# EAGLE design GardenJarLight_V1 (EAGLE 7.5.0)
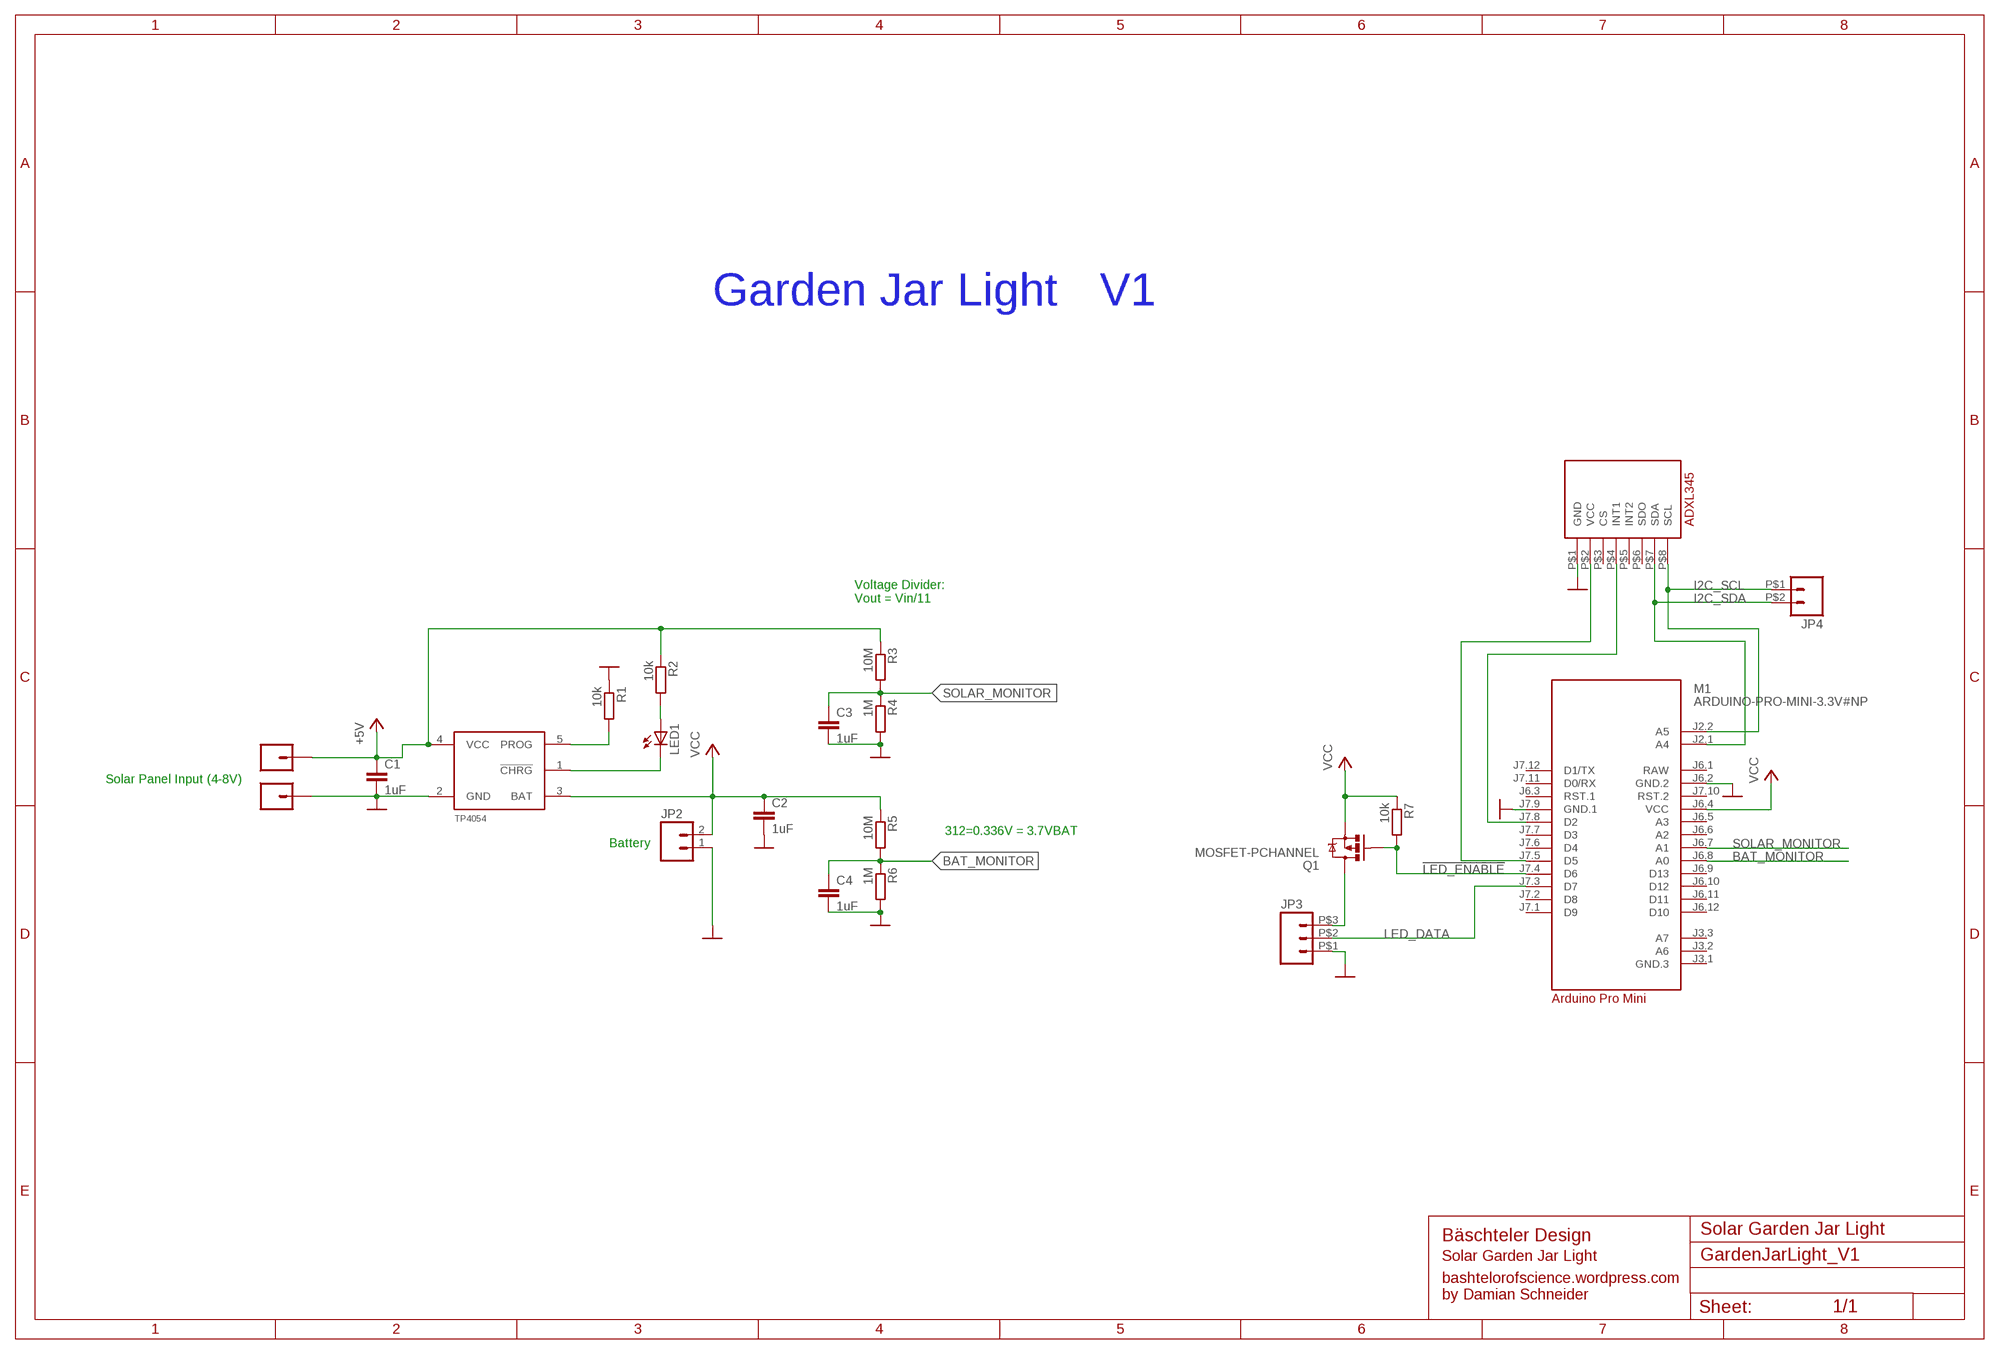
[diagram p0: schematic, sheet 1]

## Parts
C1  1uF  C-EUC0805  [C0805]
C2  1uF  C-EUC0805  [C0805]
C3  1uF  C-EUC0805  [C0805]
C4  1uF  C-EUC0805  [C0805]
IC1  TP4054_LIPO_CHARGER  [SOT23-5]
JP1  M01PTH  [1X01]
JP2  M021X02_NO_SILK  [1X02_NO_SILK]
JP3  M03SMD_LONG  [SMD_HEADER_3P_LONG]
JP4  M02  [SMD_HEADER_2P]
JP5  M01PTH  [1X01]
LED1  LEDCHIPLED_0805  [CHIPLED_0805]
M1  ARDUINO-PRO-MINI-3.3V#NP  [ARDUINO-PRO-MINI#NP]
Q1  MOSFET-PCHANNEL  [SOT23-3]
R1  10k  R-EU_R0805  [R0805]
R2  10k  R-EU_R0805  [R0805]
R3  10M  R-EU_R0805  [R0805]
R4  1M  R-EU_R0805  [R0805]
R5  10M  R-EU_R0805  [R0805]
R6  1M  R-EU_R0805  [R0805]
R7  10k  R-EU_R0805  [R0805]
U$1  ADXL345  [ADXL345]

## Nets
!LED_ENABLE: M1.J7.4(D6) Q1.1(G) R7.2
+5V: C1.1 IC1.4(VCC) JP1.1 R2.1 R3.1
BAT_MONITOR: C4.1 M1.J6.8(A0) R5.2 R6.1
GND: C1.2 C2.2 C3.2 C4.2 IC1.2(GND) JP2.1 JP3.P$1 JP5.1 M1.J6.2(GND.2) M1.J7.9(GND.1) R1.1 R4.2 R6.2 U$1.P$1(GND)
I2C_SCL: JP4.P$1 M1.J2.2(A5) U$1.P$8(SCL)
I2C_SDA: JP4.P$2 M1.J2.1(A4) U$1.P$7(SDA)
LED_DATA: JP3.P$2 M1.J7.3(D7)
N$1: JP3.P$3 Q1.3(D)
N$3: IC1.1(!CHRG) LED1.C
N$4: IC1.5(PROG) R1.2
N$7: M1.J7.8(D2) U$1.P$4(INT1)
N$9: M1.J7.5(D5) U$1.P$2(VCC)
N$37: LED1.A R2.2
SOLAR_MONITOR: C3.1 M1.J6.7(A1) R3.2 R4.1
VCC: C2.1 IC1.3(BAT) JP2.2 M1.J6.4(VCC) Q1.2(S) R5.1 R7.1
Unconnected: M1.J3.1(GND.3) M1.J3.2(A6) M1.J3.3(A7) M1.J6.3(RST.1) M1.J6.5(A3) M1.J6.6(A2) M1.J6.9(D13) M1.J6.10(D12) M1.J6.11(D11) M1.J6.12(D10) M1.J7.1(D9) M1.J7.2(D8) M1.J7.6(D4) M1.J7.7(D3) M1.J7.10(RST.2) M1.J7.11(D0/RX) M1.J7.12(D1/TX) U$1.P$3(CS) U$1.P$5(INT2) U$1.P$6(SDO)

## Notes on the sheet
- Garden Jar Light | V1
- Voltage Divider:
  Vout = Vin/11
- Solar Panel Input (4-8V)
- 312=0.336V = 3.7VBAT
- Battery
- Arduino Pro Mini
- Solar Garden Jar Light
- Bäschteler Design
- Solar Garden Jar Light
- bashtelorofscience.wordpress.com
  by Damian Schneider

## Power pins joined to a net without a drawn wire
RAW: M1.J6.1(RAW)

## Library data of the parts
C1-C4 = resistor:C-EU: CAPACITOR, European symbol
IC1 = TP4054_lipocharger:TP4054_LIPO_CHARGER
JP1 JP5 = SparkFun-Connectors:M01: Header 1 Standard 1-pin 0.1" header. Use with straight break away headers (SKU : PRT-00116), right angle break away headers (PRT-00553), swiss pins (PRT-00743), machine pins (PRT-00117), and female headers (PRT-00115).
JP2 JP4 = smd_pinheader:M02: Standard 2-pin 0.1" header. Use with - straight break away headers ( PRT-00116) - right angle break away headers (PRT-00553) - swiss pins (PRT-00743) - machine pins (PRT-00117) - female headers (PRT-00115) Molex polarized connector foot print use with: PRT-08233 with associated crimp pins and housings. 2.54_SCREWTERM for use with PRT-10571. 3.5mm Screw Terminal footprints for PRT-08084 5mm Screw Terminal footprints for use with PRT-08432
JP3 = smd_pinheader:M03: Header 3 Standard 3-pin 0.1" header. Use with straight break away headers (SKU : PRT-00116), right angle break away headers (PRT-00553), swiss pins (PRT-00743), machine pins (PRT-00117), and female headers (PRT-00115). Molex polarized connector foot print use with SKU : PRT-08232 with associated crimp pins and housings.
LED1 = led:LED: LED OSRAM: - CHIPLED LG R971, LG N971, LY N971, LG Q971, LY Q971, LO R971, LY R971 LH N974, LH R974 LS Q976, LO Q976, LY Q976 LO Q996 - Hyper CHIPLED LW Q18S LB Q993, LB Q99A, LB R99A - SideLED LS A670, LO A670, LY A670, LG A670, LP A670 LB A673, LV A673, LT A673, LW A673 LH A674 LY A675 LS A676, LA A676, LO A676, LY A676, LW A676 LS A679, LY A679, LG A679 - Hyper Micro SIDELED® LS Y876, LA Y876, LO Y876, LY Y876 LT Y87S - SmartLED LW L88C, LW L88S LB L89C, LB L89S, LG L890 LS L89K, LO L89K, LY L89K LS L896, LA L896, LO L896, LY L896 - TOPLED LS T670, LO T670, LY T670, LG T670, LP T670 LSG T670, LSP T670, LSY T670, LOP T670, LYG T670 LG T671, LOG T671, LSG T671 LB T673, LV T673, LT T673, LW T673 LH T674 LS T676, LA T676, LO T676, LY T676, LB T676, LH T676, LSB T676, LW T676 LB T67C, LV T67C, LT T67C, LS T67K, LO T67K, LY T67K, LW E67C LS E67B, LA E67B, LO E67B, LY E67B, LB E67C, LV E67C, LT E67C LW T67C LS T679, LY T679, LG T679 LS T770, LO T770, LY T770, LG T770, LP T770 LB T773, LV T773, LT T773, LW T773 LH T774 LS E675, LA E675, LY E675, LS T675 LS T776, LA T776, LO T776, LY T776, LB T776 LHGB T686 LT T68C, LB T68C - Hyper Mini TOPLED® LB M676 - Mini TOPLED Santana® LG M470 LS M47K, LO M47K, LY M47K Source: http://www.osram.convergy.de LUXEON: - LUMILED® LXK2-PW12-R00, LXK2-PW12-S00, LXK2-PW14-U00, LXK2-PW14-V00 LXK2-PM12-R00, LXK2-PM12-S00, LXK2-PM14-U00 LXK2-PE12-Q00, LXK2-PE12-R00, LXK2-PE12-S00, LXK2-PE14-T00, LXK2-PE14-U00 LXK2-PB12-K00, LXK2-PB12-L00, LXK2-PB12-M00, LXK2-PB14-N00, LXK2-PB14-P00, LXK2-PB14-Q00 LXK2-PR12-L00, LXK2-PR12-M00, LXK2-PR14-Q00, LXK2-PR14-R00 LXK2-PD12-Q00, LXK2-PD12-R00, LXK2-PD12-S00 LXK2-PH12-R00, LXK2-PH12-S00 LXK2-PL12-P00, LXK2-PL12-Q00, LXK2-PL12-R00 Source: www.luxeon.com KINGBRIGHT: KA-3528ASYC Source: www.kingbright.com
M1 = diy-modules:ARDUINO-PRO-MINI-*#NP: Arduino Pro Mini (and compatible devices) without programming pads More details available here: https://www.arduino.cc/en/Main/ArduinoBoardProMini Click here to find device on ebay.com <http://www.ebay.com/sch/arduino+pro+mini>
Q1 = SparkFun-DiscreteSemi:MOSFET-PCHANNEL: Generic PMOSFET IRLML2244 - TRANS-11153 (SOT-23 -20V -4.3A) (1.Gate 2.Source 3.Drain) FQP27P06 - COM-10349 <http://www.sparkfun.com/products/10349> (TO-220 -60V -27A) (1.Gate 2.Source 3.Drain); PROD_ID: TRANS-08285
R1-R7 = resistor:R-EU_: RESISTOR, European symbol
U$1 = davidbeermann:ADXL345: ADXL345 Digital 3-Axis Accelerometer The sensor module ADXL345 is a 3-axis accelerometer with low power consumption. This module was purchased at Eckstein Komponente <http://eckstein-shop.de/GY-291-ADXL345-Digital-3-Axis-Gravity-Acceleration-Beschleunigung-Sensor_1>.

## Board
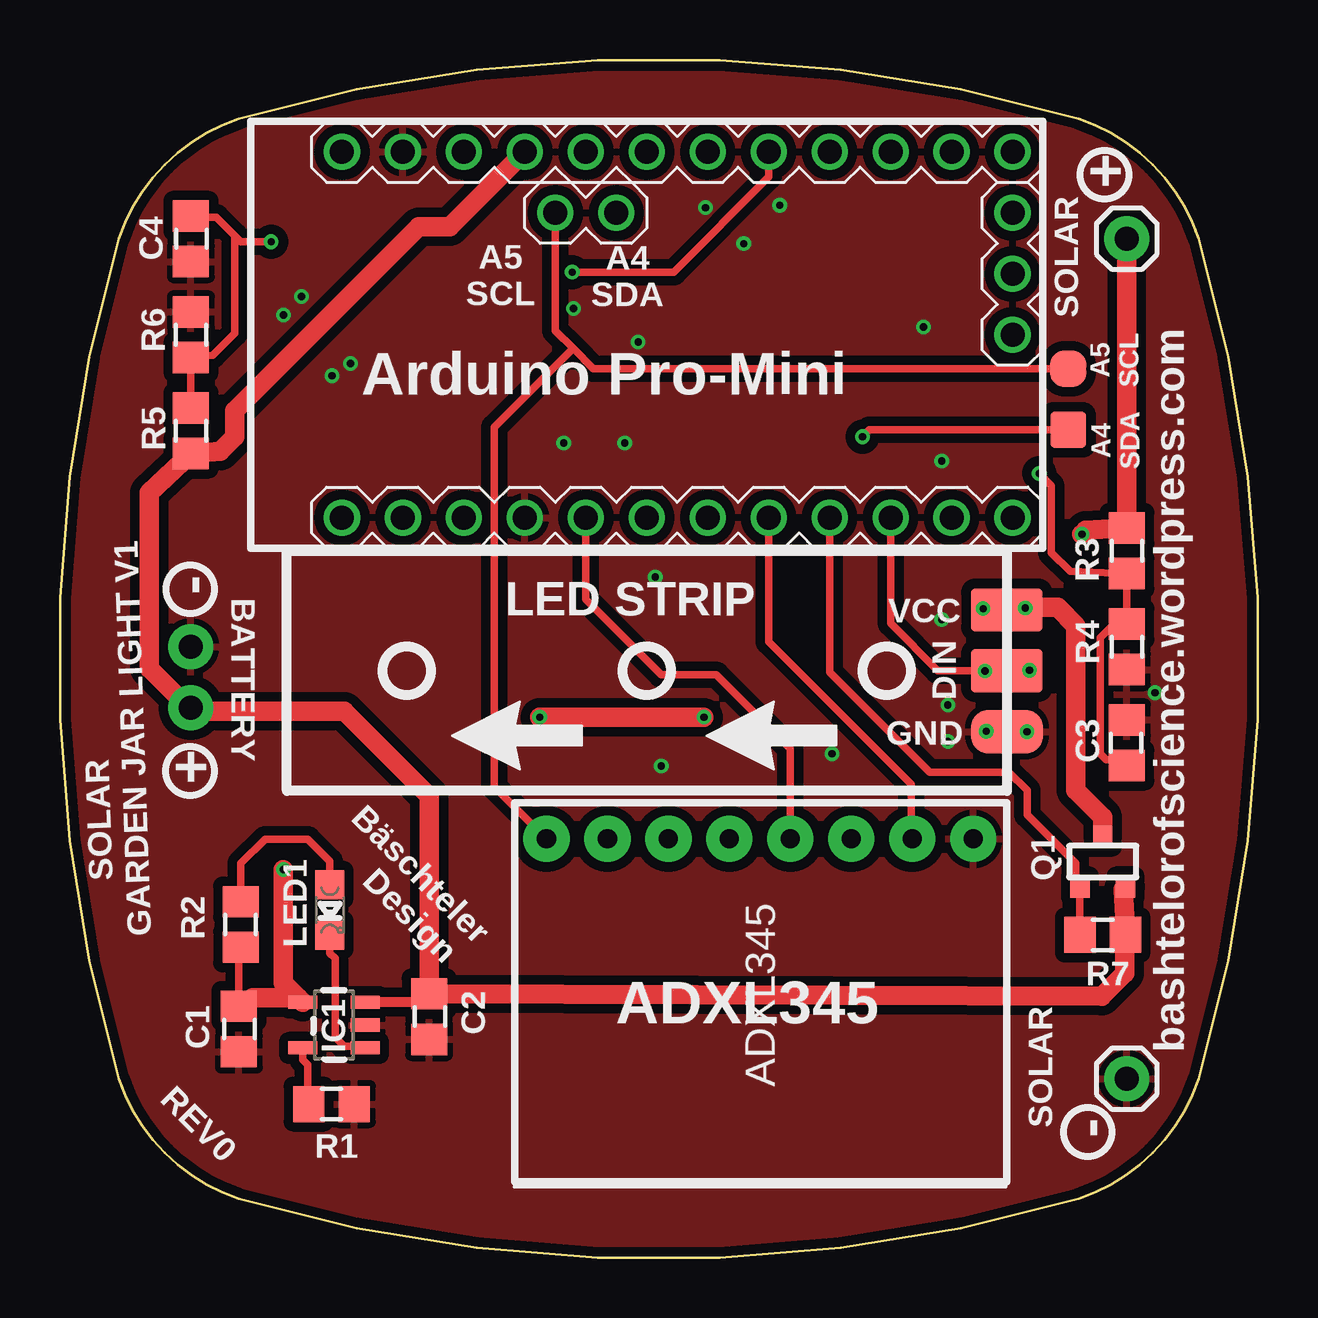
[diagram p1: board, top side]
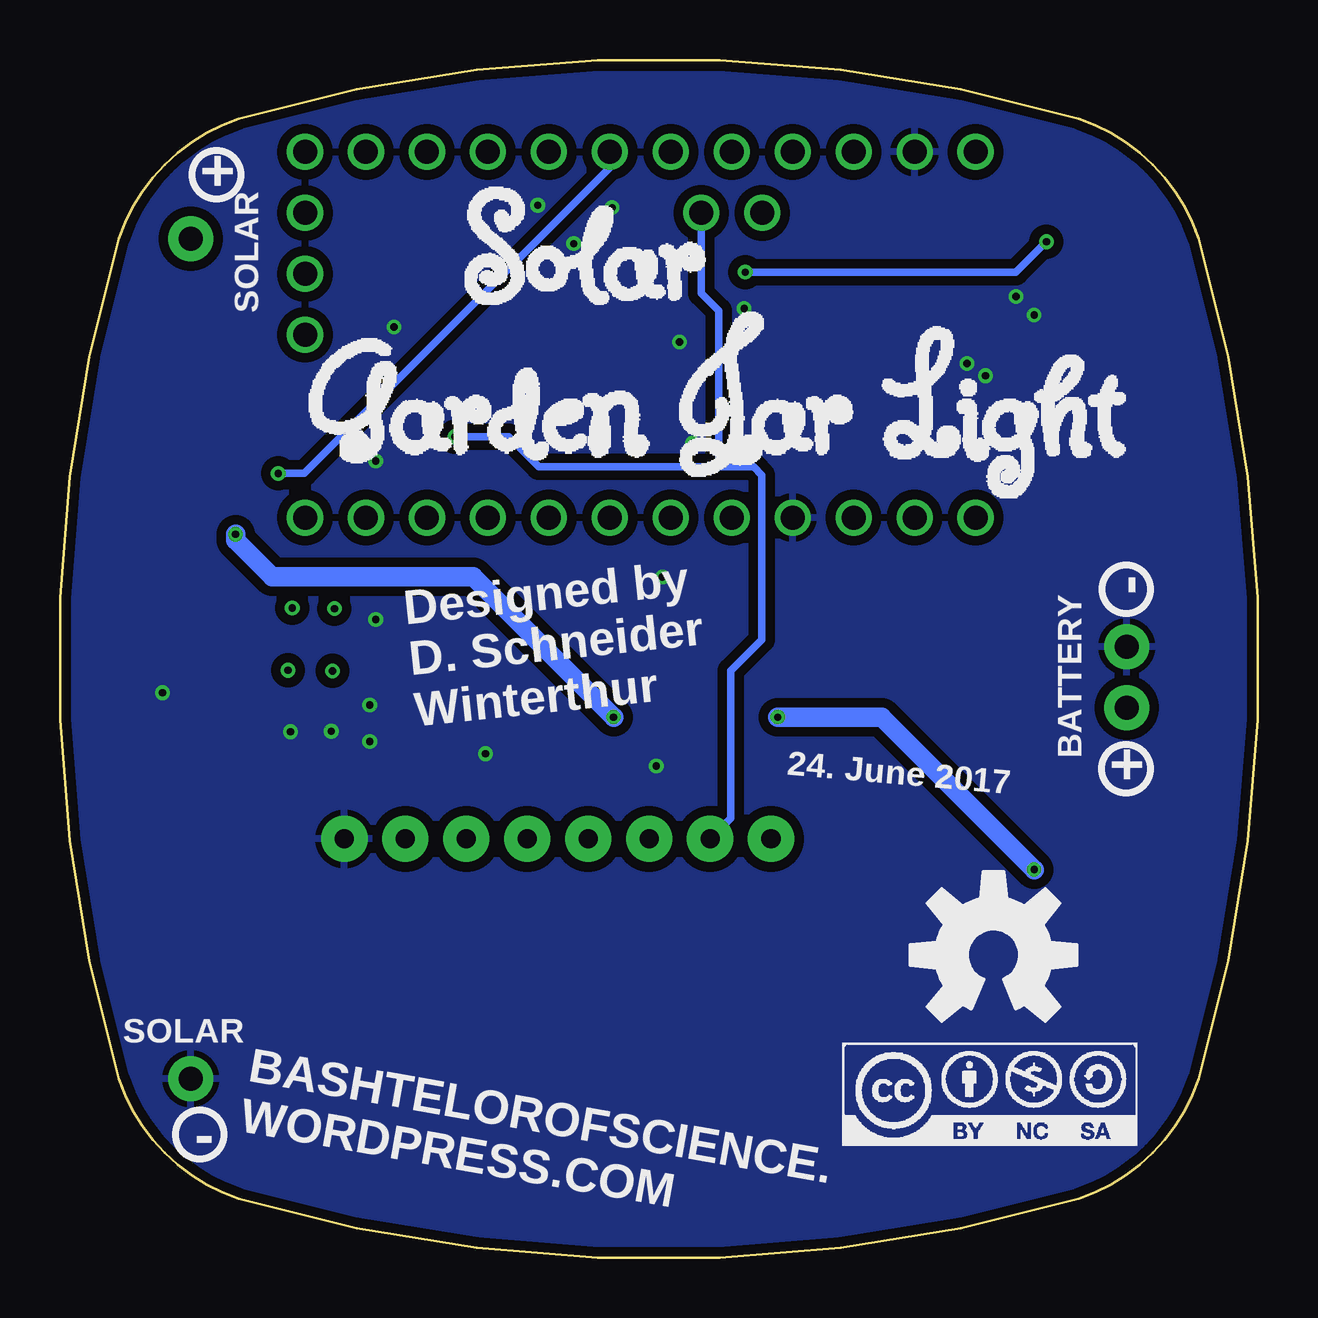
[diagram p2: board, bottom side, seen from below]

Size 49.9 x 49.9 mm. Coordinates in mm from the lower left corner, seen from the top.
Outline: 2.45,42.45 arc33 2.45,7.45 arc53 7.45,2.45 arc33 42.45,2.45 arc53 47.45,7.45 arc33 47.45,42.45 arc53 42.45,47.45 arc33 7.45,47.45 arc53 2.45,42.45
Copper layers (1*16): Top 0.035mm / dielectric 1.5mm / Bottom 0.035mm
Design rules "dirt_cheap_dirty_boards.v1 *": minimum track width 7mil, minimum drill 12mil, track to track 8mil, track to pad 8mil, pad to pad 8mil, via to via 8mil, smd to smd 0mil, copper to edge 10mil, drill to drill 10mil, minimum pad ring 10mil, minimum via ring 6mil, stop-mask expansion 2mil, vias tented up to drill 25mil, thermal gap 10mil

### Footprints (pad centres in the part's own frame; a part is rotated, then mirrored left to right if it is on the bottom)
C0805 = smd 1.3 x 1.5: 1 -0.95,0; 2 0.95,0
SOT23-5 = smd 0.55 x 1.2: 1 -0.95,-1.3; 2 0,-1.3; 3 0.95,-1.3; 4 0.95,1.3; 5 -0.95,1.3
1X01 = drill 1.016 pad 1.88: 1 0,0
1X02_NO_SILK = drill 1.016 pad 1.88: 1 0,0; 2 2.54,0
SMD_HEADER_3P_LONG = smd 1.8 x 3: P$1 -2.54,0; P$2 0,0; P$3 2.54,0
SMD_HEADER_2P = smd 1.5 x 1.5: P$1 0,0; P$2 2.54,0
CHIPLED_0805 = smd 1.2 x 1.2: A 0,-1.05; C 0,1.05
ARDUINO-PRO-MINI#NP = drill 1: J2.1 -1.27,5.08; J2.2 -3.81,5.08; J3.1 15.24,0; J3.2 15.24,2.54; J3.3 15.24,5.08; J6.1 -12.7,7.62; J6.2 -10.16,7.62; J6.3 -7.62,7.62; J6.4 -5.08,7.62; J6.5 -2.54,7.62; J6.6 0,7.62; J6.7 2.54,7.62; J6.8 5.08,7.62; J6.9 7.62,7.62; J6.10 10.16,7.62; J6.11 12.7,7.62; J6.12 15.24,7.62; J7.1 15.24,-7.62; J7.2 12.7,-7.62; J7.3 10.16,-7.62; J7.4 7.62,-7.62; J7.5 5.08,-7.62; J7.6 2.54,-7.62; J7.7 0,-7.62; J7.8 -2.54,-7.62; J7.9 -5.08,-7.62; J7.10 -7.62,-7.62; J7.11 -10.16,-7.62; J7.12 -12.7,-7.62
SOT23-3 = smd 0.8 x 0.9: 1 -0.95,-1; 2 0.95,-1; 3 0,1.1
R0805 = smd 1.3 x 1.5: 1 -0.95,0; 2 0.95,0
ADXL345 = drill 0.8 pad 1.93: P$1 0,0; P$2 0,-2.54; P$3 0,-5.08; P$4 0,-7.62; P$5 0,-10.16; P$6 0,-12.7; P$7 0,-15.24; P$8 0,-17.78

### Placement (x,y rotation side)
C1  7.45,9.52 270 top
C2  15.39,10.04 270 top
C3  44.45,21.45 90 top
C4  5.45,42.45 270 top
IC1  11.42,9.69 90 top
JP1  44.45,42.45 0 top
JP2  5.45,25.45 270 top
JP3  39.45,24.45 90 top
JP4  42.01,37.03 270 top
JP5  44.45,7.45 0 top
LED1  11.24,14.48 180 top
M1  24.45,38.45 0 top
Q1  43.45,16.45 0 top
R1  11.31,6.39 180 top
R2  7.53,13.88 90 top
R3  44.45,29.45 270 top
R4  44.45,25.45 270 top
R5  5.45,34.45 90 top
R6  5.45,38.45 90 top
R7  43.45,13.45 180 top
U$1  38.05,17.45 270 top
U$4  [CC-BY-NC-SA]  17.29,4.68 0 bottom
U$33  [OSHW-LOGO-L]  11,12.6 0 bottom

### Tracks (layer width: path | path; a pad name or v marks a point on that pad's centre or on a via)
!LED_ENABLE
  Top 0.305: R7.2 Q1.1 42.33,15.62 42.33,16.42 40.29,18.45 40.29,19.47 39.53,20.23 36.23,20.23 32.07,24.39 M1.J7.4
+5V  (via drill 0.3)
  Top 0.305: R2.1 7.45,12.8 C1.1
  Top 0.813: JP1.1 R3.1 42.74,30.3 v42.58,30.13 | C1.1 7.58,10.37 8.04,10.83 9.92,10.83 IC1.4 9.31,11.45 v9.31,16.16 | v19.99,22.51 v26.83,22.51
  Bottom 0.813: v9.31,16.16 15.66,22.51 v19.99,22.51 | v26.83,22.51 32.67,28.36 41.06,28.36 42.58,29.88 v42.58,30.13
BAT_MONITOR  (via drill 0.3)
  Top 0.305: C4.1 5.49,43.34 6.51,43.34 7.27,42.58 | 7.27,42.58 7.27,38.52 6.36,37.6 R6.1 R5.2 | 7.27,42.58 7.53,42.33 v8.8,42.33 | v21.34,41.06 25.56,41.06 29.53,45.02 M1.J6.8
  Bottom 0.305: v8.8,42.33 10.07,41.06 v21.34,41.06
GND  (via drill 0.3)
  other vias: 11.34,36.74 12.1,37.25 9.31,39.28 10.07,40.04 32.17,20.99 25.05,20.48 24.8,28.36 20.99,33.94 23.53,33.94 36.99,23.02 36.99,21.5 45.63,23.53 36.74,26.58 36.74,33.18 35.98,38.77 21.39,39.54 24.09,38.14 26.89,43.74 29.99,43.84 28.49,42.24 38.59,21.93 40.29,21.91
  pour Top (isolate 0.4): 2.45,47.45 arc30 2.45,2.45 arc30 47.45,2.45 arc31 47.45,47.45 arc30
  pour Bottom (isolate 0.4): 2.45,2.41 arc-30 2.45,47.41 arc-31 47.45,47.41 arc-30 47.45,2.41 arc-30
I2C_SCL
  Top 0.305: M1.J2.2 20.64,38.61 21.38,37.88 | 21.38,37.88 22.22,37.03 JP4.P$1 | U$1.P$8 18.1,19.62 18.1,34.6 21.38,37.88
I2C_SDA  (via drill 0.3)
  Top 0.305: v33.44,34.2 33.73,34.49 JP4.P$2
  Bottom 0.305: v33.44,34.2 31.2,34.2 29.95,32.95 22.45,32.95 | U$1.P$7 21.95,18.31 21.95,24.45 20.65,25.75 20.65,32.6 21,32.95 22.45,32.95 | 22.45,32.95 22.45,39.45 23.18,40.18 M1.J2.1
LED_DATA  (via drill 0.3)
  Top 0.305: JP3.P$2 36.58,24.45 34.61,26.42 M1.J7.3
  Top 0.406: v38.54,24.44 JP3.P$2 39.45,24.47 v40.4,24.47
N$1  (via drill 0.3)
  Top 0.406: v38.47,27.04 39.45,27.04 | v40.22,27.06 40.22,27.04 39.45,27.04 | 39.45,27.04 JP3.P$3
  Top 0.813: JP3.P$3 39.55,27.09 41.56,27.09 42.33,26.32 42.33,19.47 43.45,18.34 Q1.3
N$3
  Top 0.305: IC1.1 12.65,8.8 11.85,8.8 11.46,9.19 11.46,12.47 11.24,12.68 LED1.C
N$4
  Top 0.305: R1.2 10.32,6.53 10.32,8.04 10.12,8.24 IC1.5
N$7
  Top 0.305: U$1.P$4 30.43,21.2 27.34,24.29 25.05,24.29 21.91,27.44 M1.J7.8
N$9
  Top 0.305: U$1.P$2 35.47,17.49 35.47,19.72 29.53,25.66 M1.J7.5
N$37
  Top 0.305: R2.2 7.53,16.42 8.54,17.43 10.32,17.43 11.24,16.51 LED1.A
SOLAR_MONITOR  (via drill 0.3)
  Top 0.305: v40.8,32.67 41.31,32.17 41.31,29.37 42.08,28.6 R3.2 R4.1 43.82,26.3 43.34,25.82 43.34,20.99 43.6,20.74 44.31,20.74 C3.1
  Bottom 0.305: v40.8,32.67 39.72,32.67 26.95,45.45 26.95,46.03 M1.J6.7
VCC
  Top 0.406: C2.1 15.13,10.64 IC1.3
  Top 0.813: Q1.2 44.3,15.35 R7.1 44.36,13.39 44.36,11.85 43.4,10.89 C2.1 15.39,19.23 11.85,22.77 5.59,22.77 JP2.2 5.36,22.91 3.72,24.55 3.72,31.87 R5.1 6.67,33.6 7.27,34.2 7.27,35.27 14.95,42.95 16.25,42.95 M1.J6.4

### Text on the board
tNames: + | SOLAR | A5 / SCL | A4 / SDA | A5 / SCL | Arduino Pro-Mini | A4 / SDA | - | VCC | LED STRIP | DIN | BATTERY | GND | + | Bäschteler | SOLAR / GARDEN JAR LIGHT V1 | Design | ADXL345 | bashtelorofscience.wordpress.com | SOLAR | REV0 | -
bNames: + | SOLAR | - | BATTERY | Designed by / D. Schneider / Winterthur | + | 24. June 2017 | SOLAR | BASHTELOROFSCIENCE. / WORDPRESS.COM | -